# Altium schematic sheet Sensors.SchDoc: Payload Card Sensors
size A3; Revision: 1A; SheetNumber: 5; SheetTotal: 7; Organization: Brickworks; Address1: Matthew Glazer; Address2: Design Engineer
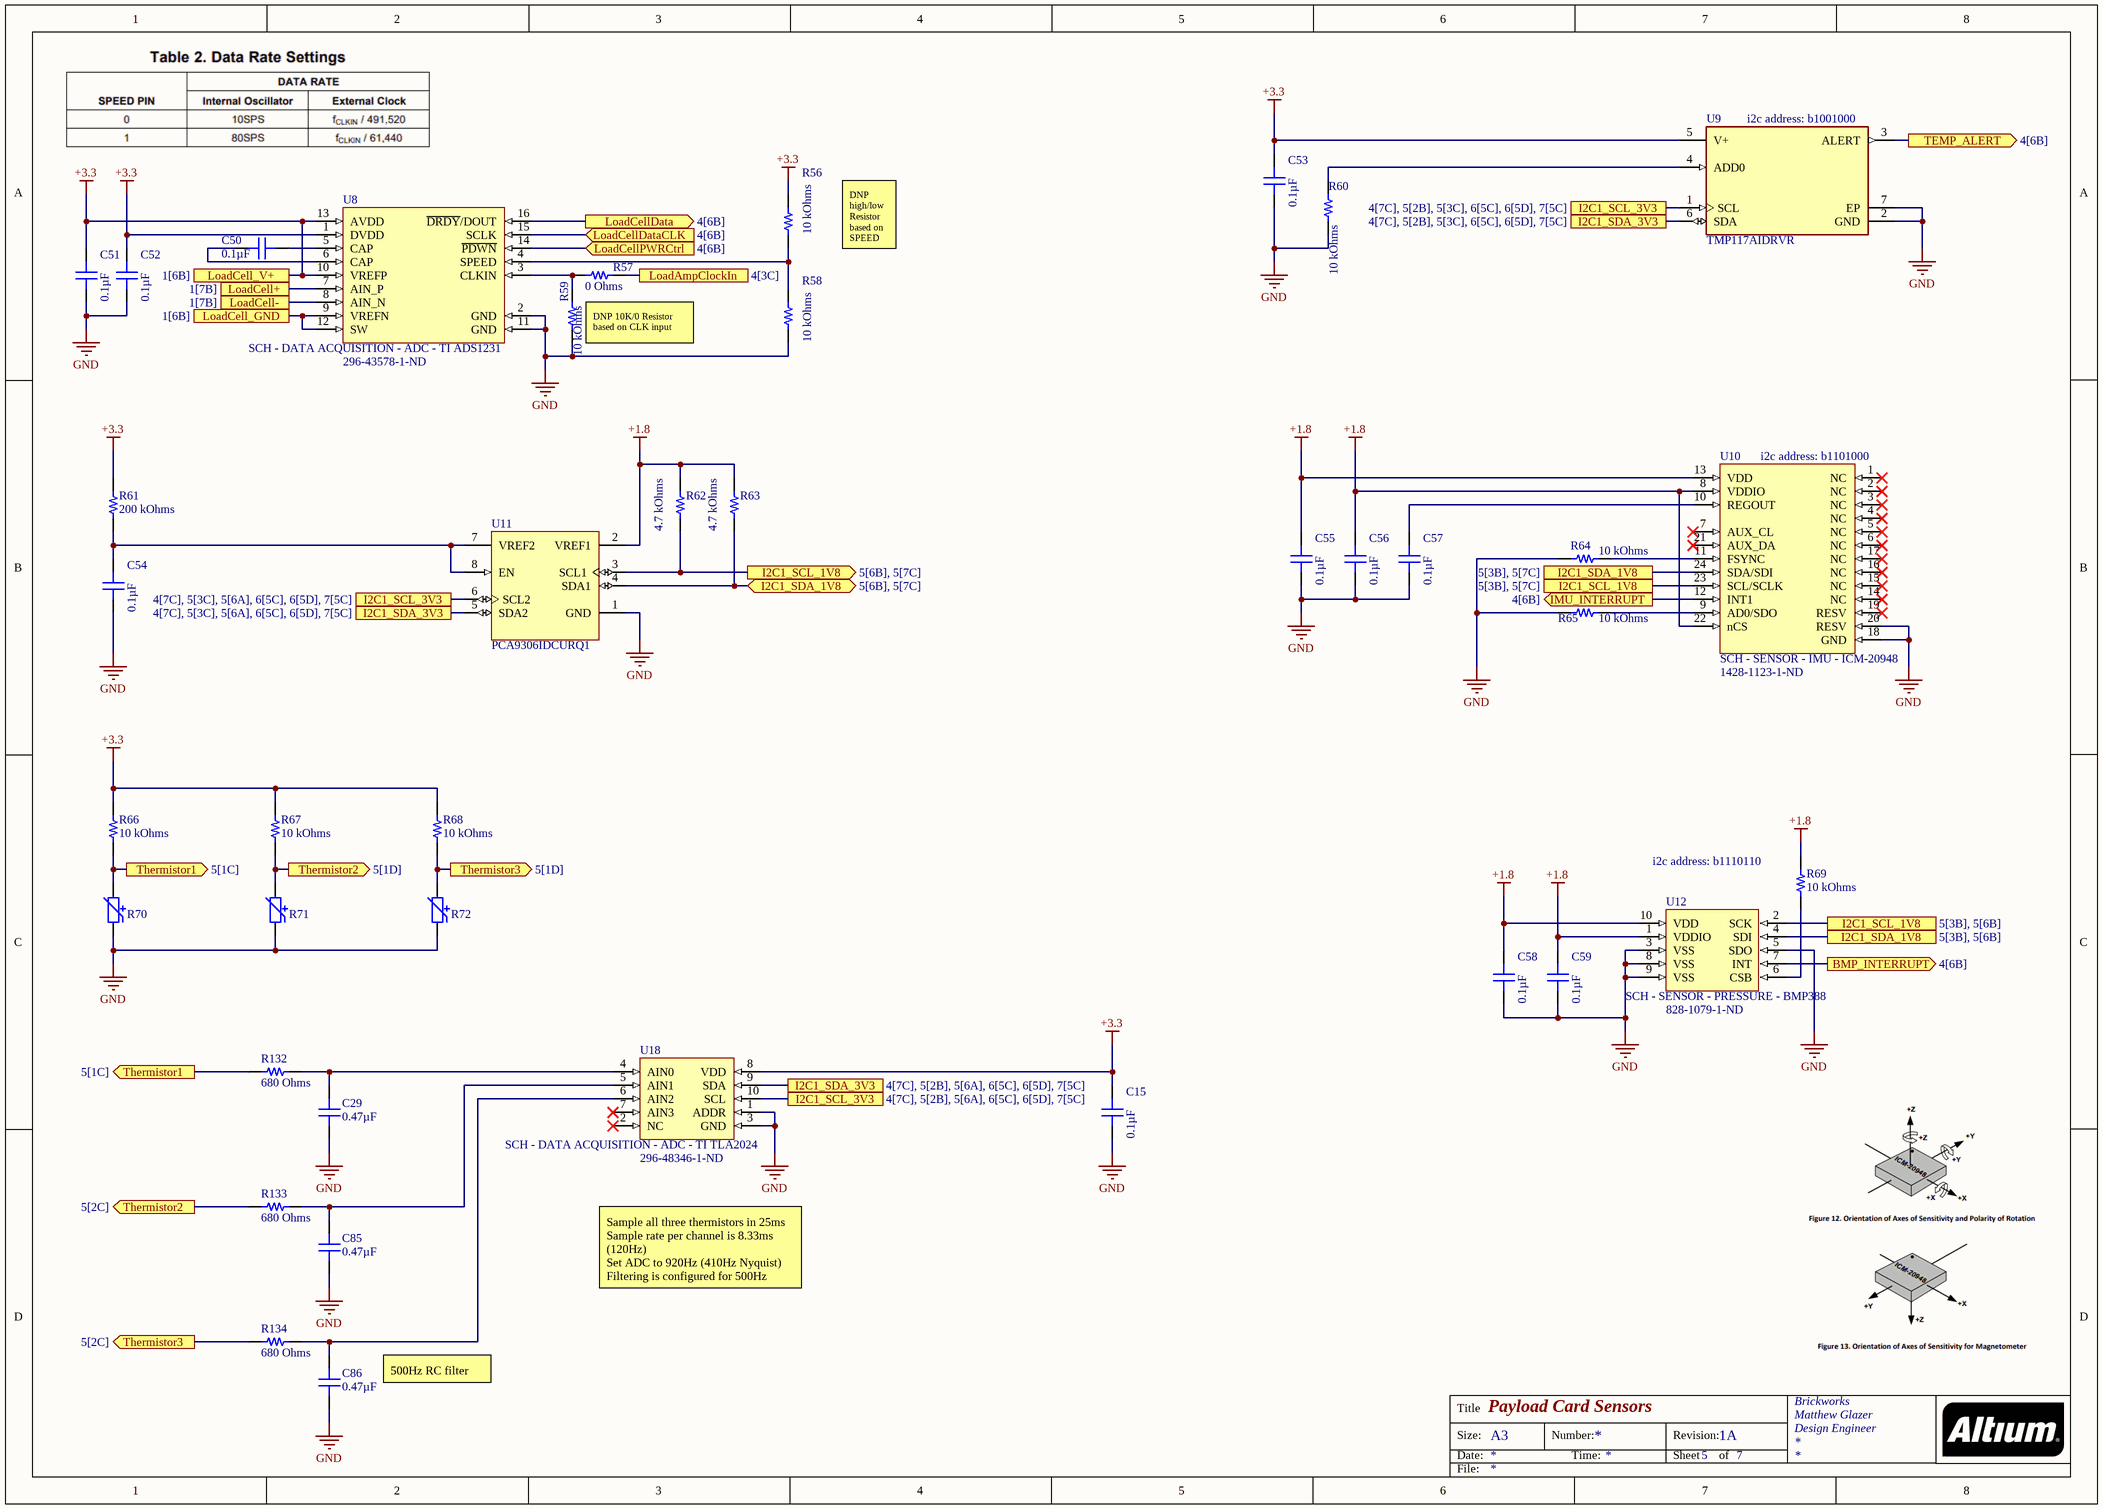
[diagram p0: Sensors.SchDoc]

## Parts
C15  0.1µF  [CAP 0603_1608]
C29  0.47µF  [CAP 0603_1608]
C50  0.1µF  [CAP 0603_1608]
C51  0.1µF  [CAP 0603_1608]
C52  0.1µF  [CAP 0603_1608]
C53  0.1µF  [CAP 0603_1608]
C54  0.1µF  [CAP 0603_1608]
C55  0.1µF  [CAP 0603_1608]
C56  0.1µF  [CAP 0603_1608]
C57  0.1µF  [CAP 0603_1608]
C58  0.1µF  [CAP 0603_1608]
C59  0.1µF  [CAP 0603_1608]
C85  0.47µF  [CAP 0603_1608]
C86  0.47µF  [CAP 0603_1608]
R56  10 kOhms  [RES 0603_1608]
R57  0 Ohms  [RES 0603_1608]
R58  10 kOhms  [RES 0603_1608]
R59  10 kOhms  [RES 0603_1608]
R60  10 kOhms  [RES 0603_1608]
R61  200 kOhms  [RES 0603_1608]
R62  4.7 kOhms  [RES 0603_1608]
R63  4.7 kOhms  [RES 0603_1608]
R64  10 kOhms  [RES 0603_1608]
R65  10 kOhms  [RES 0603_1608]
R66  10 kOhms  [RES 0603_1608]
R67  10 kOhms  [RES 0603_1608]
R68  10 kOhms  [RES 0603_1608]
R69  10 kOhms  [RES 0603_1608]
R70  10 kOhms  [PTC 0402_1005]  (value not drawn)
R71  10 kOhms  [PTC 0402_1005]  (value not drawn)
R72  10 kOhms  [PTC 0402_1005]  (value not drawn)
R132  680 Ohms  [RES 0603_1608]
R133  680 Ohms  [RES 0603_1608]
R134  680 Ohms  [RES 0603_1608]
U8  SCH - DATA ACQUISITION - ADC - TI ADS1231  Supplier Part Number 1: 296-43578-1-ND  [PCB - LEADS - SOIC - TI 16-SOIC]
U9  TMP117AIDRVR  [FP-DRV0006A-MFG]
U10  SCH - SENSOR - IMU - ICM-20948  Supplier Part Number 1: 1428-1123-1-ND  [PCB - LEADLESS - QFN - TDK 24-TFQFN]
U11  PCA9306IDCURQ1  [DCU0008A_M]
U12  SCH - SENSOR - PRESSURE - BMP388  Supplier Part Number 1: 828-1079-1-ND  [PCB - LEADLESS - BOSCH LGA10]
U18  SCH - DATA ACQUISITION - ADC - TI TLA2024  Supplier Part Number 1: 296-48346-1-ND  [PCB - LEADLESS - QFN - TI X2QFN-10]

## Ports
BMP_INTERRUPT (out, see 4[6B]), I2C1_SCL_1V8 (out, see 5[6B], 5[7C]), I2C1_SCL_1V8 (see 5[3B], 5[6B]), I2C1_SCL_1V8 (see 5[3B], 5[7C]), I2C1_SCL_3V3 (see 4[7C], 5[2B], 5[3C], 6[5C], 6[5D], 7[5C]), I2C1_SCL_3V3 (see 4[7C], 5[2B], 5[6A], 6[5C], 6[5D], 7[5C]), I2C1_SCL_3V3 (see 4[7C], 5[3C], 5[6A], 6[5C], 6[5D], 7[5C]), I2C1_SDA_1V8 (bidir, see 5[6B], 5[7C]), I2C1_SDA_1V8 (see 5[3B], 5[6B]), I2C1_SDA_1V8 (see 5[3B], 5[7C]), I2C1_SDA_3V3 (see 4[7C], 5[2B], 5[3C], 6[5C], 6[5D], 7[5C]), I2C1_SDA_3V3 (see 4[7C], 5[2B], 5[6A], 6[5C], 6[5D], 7[5C]), I2C1_SDA_3V3 (see 4[7C], 5[3C], 5[6A], 6[5C], 6[5D], 7[5C]), IMU_INTERRUPT (out, see 4[6B]), LoadAmpClockIn (see 4[3C]), LoadCell+ (see 1[7B]), LoadCell- (see 1[7B]), LoadCell_GND (see 1[6B]), LoadCell_V+ (see 1[6B]), LoadCellData (out, see 4[6B]), LoadCellDataCLK (in, see 4[6B]), LoadCellPWRCtrl (in, see 4[6B]), TEMP_ALERT (out, see 4[6B]), Thermistor1 (out, see 5[1C]), Thermistor2 (out, see 5[1D]), Thermistor2 (out, see 5[2C]), Thermistor3 (out, see 5[1D]), Thermistor3 (out, see 5[2C])

## Nets
+1.8: C55.2 C56.2 C58.2 C59.2 R62.2 R63.2 R69.1 U10.8(VDDIO) U10.13(VDD) U10.22(nCS) U11.2(VREF1) U12.1(VDDIO) U12.10(VDD)
+3.3: C15.2 C51.2 C52.2 C53.2 R56.2 R61.2 R66.2 R67.2 R68.2 U8.1(DVDD) U8.10(VREFP) U8.13(AVDD) U9.5(V+) U18.8(VDD) ; port LoadCell_V+
GND: C15.1 C29.1 C51.1 C52.1 C53.1 C54.1 C55.1 C56.1 C57.1 C58.1 C59.1 C85.1 C86.1 R58.1 R59.1 R60.1 R64.2 R65.2 R70.1 R71.1 R72.1 U8.2(GND) U8.11(GND) U9.2(GND) U9.7(EP) U10.18(GND) U10.20(RESV) U11.1(GND) U12.3(VSS) U12.5(SDO) U12.8(VSS) U12.9(VSS) U18.1(ADDR) U18.3(GND)
BMP_INTERRUPT: U12.7(INT) ; port BMP_INTERRUPT
I2C1_SCL_1V8: R62.1 U10.23(SCL/SCLK) U11.3(SCL1) U12.2(SCK) ; port I2C1_SCL_1V8
I2C1_SCL_3V3: U9.1(SCL) U11.6(SCL2) U18.10(SCL) ; port I2C1_SCL_3V3
I2C1_SDA_1V8: R63.1 U10.24(SDA/SDI) U11.4(SDA1) U12.4(SDI) ; port I2C1_SDA_1V8
I2C1_SDA_3V3: U9.6(SDA) U11.5(SDA2) U18.9(SDA) ; port I2C1_SDA_3V3
IMU_INTERRUPT: U10.12(INT1) ; port IMU_INTERRUPT
LoadAmpClockIn: R57.2 ; port LoadAmpClockIn
LoadCell+: U8.7(AIN_P) ; port LoadCell+
LoadCell-: U8.8(AIN_N) ; port LoadCell-
LoadCell_GND: U8.9(VREFN) U8.12(SW) ; port LoadCell_GND
LoadCellData: U8.16(~{DRDY}/DOUT) ; port LoadCellData
LoadCellDataCLK: U8.15(SCLK) ; port LoadCellDataCLK
LoadCellPWRCtrl: U8.14(~{PDWN}) ; port LoadCellPWRCtrl
TEMP_ALERT: U9.3(ALERT) ; port TEMP_ALERT
Thermistor1: R66.1 R70.2 R132.1 ; port Thermistor1
Thermistor2: R67.1 R71.2 R133.1 ; port Thermistor2
Thermistor3: R68.1 R72.2 R134.1 ; port Thermistor3
NetC29_2: C29.2 R132.2 U18.4(AIN0)
NetC50_1: C50.1 U8.5(CAP)
NetC50_2: C50.2 U8.6(CAP)
NetC54_2: C54.2 R61.1 U11.7(VREF2) U11.8(EN)
NetC57_2: C57.2 U10.10(REGOUT)
NetC85_2: C85.2 R133.2 U18.5(AIN1)
NetC86_2: C86.2 R134.2 U18.6(AIN2)
NetR56_1: R56.1 R58.2 U8.4(SPEED)
NetR57_1: R57.1 R59.2 U8.3(CLKIN)
NetR60_2: R60.2 U9.4(ADD0)
NetR64_1: R64.1 U10.11(FSYNC)
NetR65_1: R65.1 U10.9(AD0/SDO)
NetR69_2: R69.2 U12.6(CSB)

Not connected (* = marked no-connect by the designer): U10 1(NC)* 2(NC)* 3(NC)* 4(NC)* 5(NC)* 6(NC)* 7(AUX_CL)* 14(NC)* 15(NC)* 16(NC)* 17(NC)* 19(RESV)* 21(AUX_DA)*; U18 2(NC)* 7(AIN3)*

## Notes on the sheet
- (near U9) i2c address: b1001000
- DNP high/low Resistor based on SPEED
- (near R59) DNP 10K/0 Resistor based on CLK input
- (near U10) i2c address: b1101000
- (near R69) i2c address: b1110110
- Sample all three thermistors in 25ms
  Sample rate per channel is 8.33ms (120Hz)
  Set ADC to 920Hz (410Hz Nyquist)
  Filtering is configured for 500Hz
- 500Hz RC filter
- Title
- Size:
- Date:
- A3
- Number:
- Time:
- Revision:
- Sheet
- of
- File:

## Library data of the parts
C15 C50-C59 = CL10B104KA8WPNC: CAP CER 0.1UF 25V X7R 0603; Manufacturer: Samsung Electro-Mechanics; Tolerance: ±10%; Part Number: CL10B104KA8WPNC; Value: 0.1µF; Applications: Automotive; Capacitance: 0.1µF; ComponentLink1Description: Datasheet; ComponentLink1URL: http://www.samsungsem.com/kr/support/product-search/mlcc/CL10B104KA8WPNC.jsp; ComponentLink2Description: DigiKey Link; ComponentLink2URL: http://digikey.com/product-detail/en/samsung-electro-mechanics/CL10B104KA8WPNC/1276-6717-1-ND/5961576; Device Package: 0603 (1608 Metric); Features: Open Mode; LastUpdated: 9/2/2020 1:03:30 AM; Lifecycle Status: Active; Minimum Order: 1; Mounting Type: Surface Mount, MLCC; Operating Temperature: -55°C ~ 125°C; Package / Case: 0603 (1608 Metric); Packaging: TapeAndReel; PartId: 5631; Part Status: Active; Price: 0.02; Ratings: AEC-Q200; Series: CL; Size / Dimension: 0.063" L x 0.031" W (1.60mm x 0.80mm); Supplier 1: DigiKey; Supplier Part Number 1: 1276-6717-1-ND; Temperature Coefficient: X7R; Thickness (Max): 0.035" (0.90mm); Voltage - Rated: 25V
C29 C85 C86 = C0603C474K4PACTU: CAP CER 0.47UF 16V X5R 0603; Manufacturer: KEMET; Tolerance: ±10%; Part Number: C0603C474K4PACTU; Value: 0.47µF; Applications: General Purpose; Capacitance: 0.47µF; ComponentLink1Description: Datasheet; ComponentLink1URL: https://api.kemet.com/component-edge/download/datasheet/C0603C474K4PACTU.pdf; ComponentLink2Description: DigiKey Link; ComponentLink2URL: http://digikey.com/product-detail/en/kemet/C0603C474K4PACTU/399-7934-1-ND/3471657; Device Package: 0603 (1608 Metric); LastUpdated: 9/2/2020 1:03:36 AM; Lifecycle Status: Active; Minimum Order: 1; Mounting Type: Surface Mount, MLCC; Operating Temperature: -55°C ~ 85°C; Package / Case: 0603 (1608 Metric); Packaging: TapeAndReel; PartId: 2292; Part Status: Active; Price: 0.02; Series: SMD Comm X5R; Size / Dimension: 0.063" L x 0.031" W (1.60mm x 0.80mm); Supplier 1: DigiKey; Supplier Part Number 1: 399-7934-1-ND; Temperature Coefficient: X5R; Thickness (Max): 0.034" (0.87mm); Voltage - Rated: 16V
R56 R58-R60 R64 R65 R69 = RMCF0603JT10K0: RES 10K OHM 5% 1/10W 0603; Manufacturer: Stackpole Electronics Inc; Power (Watts): 0.1W, 1/10W; Temperature Coefficient: ±200ppm/°C; Part Number: RMCF0603JT10K0; Value: 10 kOhms; ComponentLink1Description: Datasheet; ComponentLink1URL: https://www.seielect.com/catalog/sei-packaging.pdf; ComponentLink2Description: DigiKey Link; ComponentLink2URL: http://digikey.com/product-detail/en/stackpole-electronics-inc/RMCF0603JT10K0/RMCF0603JT10K0CT-ND/1943191; Composition: Thick Film; Device Package: 0603 (1608 Metric); Features: Automotive AEC-Q200; Height - Seated (Max): 0.022" (0.55mm); LastUpdated: 8/30/2020 8:48:45 PM; Lifecycle Status: Active; Minimum Order: 1; Number of Terminations: 2; Operating Temperature: -55°C ~ 155°C; Package / Case: 0603 (1608 Metric); Packaging: CutTape; PartId: 25659; Part Status: Active; Price: 0.10; Ratings: AEC-Q200; Resistance: 10 kOhms; Series: RMCF; Size / Dimension: 0.061" L x 0.031" W (1.55mm x 0.80mm); Supplier 1: DigiKey; Supplier Part Number 1: RMCF0603JT10K0CT-ND; Supplier Device Package: 0603; Tolerance: ±5%
R57 = RMCF0603ZT0R00: RES 0 OHM JUMPER 1/10W 0603; Manufacturer: Stackpole Electronics Inc; Power (Watts): 0.1W, 1/10W; Part Number: RMCF0603ZT0R00; Value: 0 Ohms; ComponentLink1Description: Datasheet; ComponentLink1URL: https://www.seielect.com/catalog/sei-rmcf_rmcp.pdf; ComponentLink2Description: DigiKey Link; ComponentLink2URL: http://digikey.com/product-detail/en/stackpole-electronics-inc/RMCF0603ZT0R00/RMCF0603ZT0R00CT-ND/1943218; Composition: Thick Film; Device Package: 0603 (1608 Metric); Features: Automotive AEC-Q200; Height - Seated (Max): 0.022" (0.55mm); LastUpdated: 9/2/2020 1:09:45 AM; Lifecycle Status: Active; Minimum Order: 1; Number of Terminations: 2; Operating Temperature: -55°C ~ 155°C; Package / Case: 0603 (1608 Metric); Packaging: CutTape; PartId: 22613; Part Status: Active; Price: 0.10; Ratings: AEC-Q200; Resistance: 0 Ohms; Series: RMCF; Size / Dimension: 0.061" L x 0.031" W (1.55mm x 0.80mm); Supplier 1: DigiKey; Supplier Part Number 1: RMCF0603ZT0R00CT-ND; Supplier Device Package: 0603; Tolerance: Jumper
R61 = RMCF0603FT200K: RES 200K OHM 1% 1/10W 0603; Manufacturer: Stackpole Electronics Inc; Power (Watts): 0.1W, 1/10W; Temperature Coefficient: ±100ppm/°C; Part Number: RMCF0603FT200K; Value: 200 kOhms; ComponentLink1Description: Datasheet; ComponentLink1URL: https://www.seielect.com/catalog/sei-rmcf_rmcp.pdf; ComponentLink2Description: DigiKey Link; ComponentLink2URL: http://digikey.com/product-detail/en/stackpole-electronics-inc/RMCF0603FT200K/RMCF0603FT200KCT-ND/1943126; Composition: Thick Film; Device Package: 0603 (1608 Metric); Features: Automotive AEC-Q200; Height - Seated (Max): 0.022" (0.55mm); LastUpdated: 9/2/2020 1:10:13 AM; Lifecycle Status: Active; Minimum Order: 1; Number of Terminations: 2; Operating Temperature: -55°C ~ 155°C; Package / Case: 0603 (1608 Metric); Packaging: CutTape; PartId: 10646; Part Status: Active; Price: 0.10; Ratings: AEC-Q200; Resistance: 200 kOhms; Series: RMCF; Size / Dimension: 0.061" L x 0.031" W (1.55mm x 0.80mm); Supplier 1: DigiKey; Supplier Part Number 1: RMCF0603FT200KCT-ND; Supplier Device Package: 0603; Tolerance: ±1%
R62 R63 = RMCF0603FT4K70: RES 4.7K OHM 1% 1/10W 0603; Manufacturer: Stackpole Electronics Inc; Power (Watts): 0.1W, 1/10W; Temperature Coefficient: ±100ppm/°C; Part Number: RMCF0603FT4K70; Value: 4.7 kOhms; ComponentLink1Description: Datasheet; ComponentLink1URL: https://www.seielect.com/catalog/sei-rmcf_rmcp.pdf; ComponentLink2Description: DigiKey Link; ComponentLink2URL: http://digikey.com/product-detail/en/stackpole-electronics-inc/RMCF0603FT4K70/RMCF0603FT4K70CT-ND/1943033; Composition: Thick Film; Device Package: 0603 (1608 Metric); Features: Automotive AEC-Q200; Height - Seated (Max): 0.022" (0.55mm); LastUpdated: 9/2/2020 1:10:22 AM; Lifecycle Status: Active; Minimum Order: 1; Number of Terminations: 2; Operating Temperature: -55°C ~ 155°C; Package / Case: 0603 (1608 Metric); Packaging: CutTape; PartId: 6078; Part Status: Active; Price: 0.10; Ratings: AEC-Q200; Resistance: 4.7 kOhms; Series: RMCF; Size / Dimension: 0.061" L x 0.031" W (1.55mm x 0.80mm); Supplier 1: DigiKey; Supplier Part Number 1: RMCF0603FT4K70CT-ND; Supplier Device Package: 0603; Tolerance: ±1%
R66-R68 = RMCF0603FT10K0: RES 10K OHM 1% 1/10W 0603; Manufacturer: Stackpole Electronics Inc; Power (Watts): 0.1W, 1/10W; Temperature Coefficient: ±100ppm/°C; Part Number: RMCF0603FT10K0; Value: 10 kOhms; ComponentLink1Description: Datasheet; ComponentLink1URL: https://www.seielect.com/catalog/sei-rmcf_rmcp.pdf; ComponentLink2Description: DigiKey Link; ComponentLink2URL: http://digikey.com/product-detail/en/stackpole-electronics-inc/RMCF0603FT10K0/RMCF0603FT10K0CT-ND/1943057; Composition: Thick Film; Device Package: 0603 (1608 Metric); Features: Automotive AEC-Q200; Height - Seated (Max): 0.022" (0.55mm); LastUpdated: 9/2/2020 1:09:31 AM; Lifecycle Status: Active; Minimum Order: 1; Number of Terminations: 2; Operating Temperature: -55°C ~ 155°C; Package / Case: 0603 (1608 Metric); Packaging: CutTape; PartId: 25663; Part Status: Active; Price: 0.10; Ratings: AEC-Q200; Resistance: 10 kOhms; Series: RMCF; Size / Dimension: 0.061" L x 0.031" W (1.55mm x 0.80mm); Supplier 1: DigiKey; Supplier Part Number 1: RMCF0603FT10K0CT-ND; Supplier Device Package: 0603; Tolerance: ±1%
R70-R72 = TMP6131DECR: SENSOR PTC 10KOHM 1% X1SON; Manufacturer: Texas Instruments; ComponentLink1Description: Datasheet; ComponentLink1URL: http://www.ti.com/general/docs/suppproductinfo.tsp?distId=10&gotoUrl=http%3A%2F%2Fwww.ti.com%2Flit%2Fgpn%2Ftmp61; ComponentLink2Description: DigiKey Link; ComponentLink2URL: http://digikey.com/product-detail/en/texas-instruments/TMP6131DECR/296-TMP6131DECRCT-ND/10435285; Device Package: 0402 (1006 Metric); LastUpdated: 9/2/2020 1:30:57 AM; Lifecycle Status: Active; Part Number: TMP6131DECR; Minimum Order: 1; Mounting Type: Surface Mount; Operating Temperature: -40°C ~ 125°C (TA); Package / Case: 0402 (1006 Metric); Packaging: TapeAndReel; Part Status: Active; Price: 0.07; Resistance @ 25°C: 10 kOhms; Resistance Tolerance: ±1%; Series: Commercial; Supplier 1: DigiKey; Supplier Part Number 1: 296-TMP6131DECRCT-ND; Supplier Device Package: 2-X1SON (1x.60); Value: 10 kOhms
R132-R134 = RMCF0603FT680R: RES 680 OHM 1% 1/10W 0603; Manufacturer: Stackpole Electronics Inc; Power (Watts): 0.1W, 1/10W; Temperature Coefficient: ±100ppm/°C; Part Number: RMCF0603FT680R; Value: 680 Ohms; ComponentLink1Description: Datasheet; ComponentLink1URL: https://www.seielect.com/catalog/sei-packaging.pdf; ComponentLink2Description: DigiKey Link; ComponentLink2URL: http://digikey.com/product-detail/en/stackpole-electronics-inc/RMCF0603FT680R/RMCF0603FT680RCT-ND/6053170; Composition: Thick Film; Device Package: 0603 (1608 Metric); Features: Automotive AEC-Q200; Height - Seated (Max): 0.022" (0.55mm); LastUpdated: 9/2/2020 1:10:13 AM; Lifecycle Status: Active; Minimum Order: 1; Number of Terminations: 2; Operating Temperature: -55°C ~ 155°C; Package / Case: 0603 (1608 Metric); Packaging: CutTape; PartId: 10671; Part Status: Active; Price: 0.10; Ratings: AEC-Q200; Resistance: 680 Ohms; Series: RMCF; Size / Dimension: 0.061" L x 0.031" W (1.55mm x 0.80mm); Supplier 1: DigiKey; Supplier Part Number 1: RMCF0603FT680RCT-ND; Supplier Device Package: 0603; Tolerance: ±1%
U9 = CMP-04948-000009-1: TEMPERATURE SENSOR; Manufacturer: Texas Instruments; Operating Supply Current: 3.5-16uA; Standoff Height: 0mm; Min Supply Voltage: 1.8V; Resolution: 16bits; Interface: I2C,2-Wire,SMBus; Max Junction Temp: +150°C; Max Supply Voltage: 5.5V; Octopart: https://octopart.com/tmp117aidrvr-texas+instruments-95511044; Lead Free: Yes; ComponentLink2Description: Datasheet; Temperature Range High: +150°C; Manufacturer Part Number: TMP117AIDRVR; Ambient Temperature Range High: +150°C; Ambient Temperature Range Low: -55°C; Height: 0.8mm; ComponentLink2URL: http://www.ti.com/lit/ds/symlink/tmp117.pdf; Automotive: No; Device Class L1: Sensors; RoHS: TRUE; Package: DRV0006A; Device Class L3: unset; Temperature: -55°C to +150°C; Temperature Range Low: -55°C; Ipc Land Pattern Name: DFN200X200X80-6; Device Class L2: Temperature and Humidity Sensors; Category: IC; Digikey Description: TEMPERATURE SENSOR
U11 = CMP-0314-00424-2: Automotive Catalog Dual Bidirectional I2C Bus and SMBus Voltage-Level Translator, 0 to 5.5 V,-40 to 85 degC,8-pin US8 (DCU), Green (RoHS & no Sb/Br); Manufacturer: Texas Instruments; fSCLK(Max)(MHz): 400; Vcc range(V): 0 to 5.5; 5V Tolerant I/O: Yes; tpd max(ns): 1.4; Function: Voltage Translator; SubFamily: I2C Special Function; No. of Outputs: 2; Mounting Technology: Surface Mount; ComponentLink1Description: Datasheet; ComponentLink2Description: Package Specification; PackageReference: DCU0008A; Rating: Automotive; PackageVersion: revF, Jul-2005; Eco-Plan: Green (RoHS & no Sb/Br); ComponentLink2URL: http://www.ti.com/litv/pdf/mpds050d; Max Frequency(kHz): 400; Open Drain I/O Type: Yes; On-Chip Power-on-Reset: No; PartNumber: PCA9306IDCURQ1; Code_JEDEC: MO-187-CA; DatasheetVersion: SCPS178; PackageDescription: 8-Pin Thin Shrink Small Outline Package 0.5 mm Pitch; ComponentLink1URL: http://www.ti.com/general/docs/lit/getliterature.tsp?genericPartNumber=PCA9306-Q1&fileType=pdf; Enable Pin: Yes
U8 = SCH - DATA ACQUISITION - ADC - TI ADS1231: Supplier 1: Digi-Key
U10 = SCH - SENSOR - IMU - ICM-20948: Supplier 1: Digi-Key
U12 = SCH - SENSOR - PRESSURE - BMP388: Supplier 1: Digi-Key
U18 = SCH - DATA ACQUISITION - ADC - TI TLA2024: Supplier 1: Digi-Key